# EAGLE design sensor_28mm (EAGLE 9.1.1)
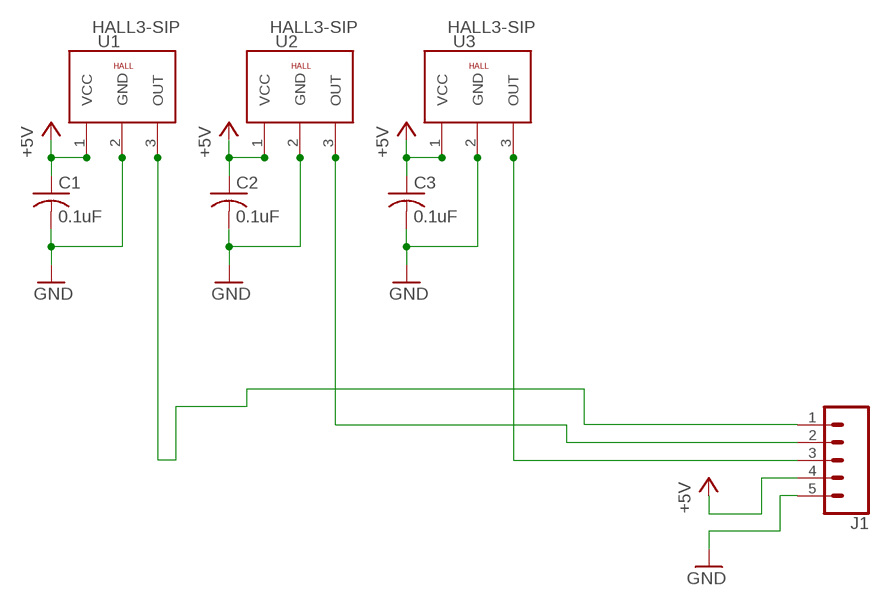
[diagram p0: schematic, sheet 1]

## Parts
C1  0.1uF  C-USC0603  [C0603]
C2  0.1uF  C-USC0603  [C0603]
C3  0.1uF  C-USC0603  [C0603]
J1  CONN_05PTH_LONGPADS  [1X05_LONGPADS]
U1  HALL3-SIP  [3PINS1,27]
U2  HALL3-SIP  [3PINS1,27]
U3  HALL3-SIP  [3PINS1,27]

## Nets
+5V: C1.1 C2.1 C3.1 J1.4 U1.1(VCC) U2.1(VCC) U3.1(VCC)
GND: C1.2 C2.2 C3.2 J1.5 U1.2(GND) U2.2(GND) U3.2(GND)
N$2: J1.1 U1.3(OUT)
N$4: J1.3 U3.3(OUT)
N$7: J1.2 U2.3(OUT)

## Library data of the parts
C1-C3 = sensor_28mm:C-US: CAPACITOR, American symbol
J1 = SparkFun-Connectors:CONN_05: Multi connection point. Often used as Generic Header-pin footprint for 0.1 inch spaced/style header connections On any of the 0.1 inch spaced packages, you can populate with these: Break Away Headers - Straight <https://www.sparkfun.com/products/116> (PRT-00116) Break Away Male Headers - Right Angle <https://www.sparkfun.com/products/553> (PRT-00553) Female Headers <https://www.sparkfun.com/products/115> (PRT-00115) Break Away Headers - Machine Pin <https://www.sparkfun.com/products/117> (PRT-00117) Break Away Female Headers - Swiss Machine Pin <https://www.sparkfun.com/products/743> (PRT-00743) For SCREWTERMINALS and SPRING TERMINALS visit here: Screw Terimnals on SparkFun.com <https://www.sparkfun.com/search/results?term=Screw+Terminals> (5mm/3.5mm/2.54mm spacing) This device is also useful as a general connection point to wire up your design to another part of your project. Our various solder wires solder well into these plated through hole pads. Hook-Up Wire - Assortment (Stranded, 22 AWG) <https://www.sparkfun.com/products/11375> (PRT-11375) Hook-Up Wire - Assortment (Solid Core, 22 AWG) <https://www.sparkfun.com/products/11367> (PRT-11367) View the entire wire category on our website here <https://www.sparkfun.com/categories/141> Special notes: Molex polarized connector foot print use with SKU : PRT-08231 with associated crimp pins and housings. 1MM SMD Version SKU: PRT-10208
U1-U3 = sensor_28mm:HALL

## Board
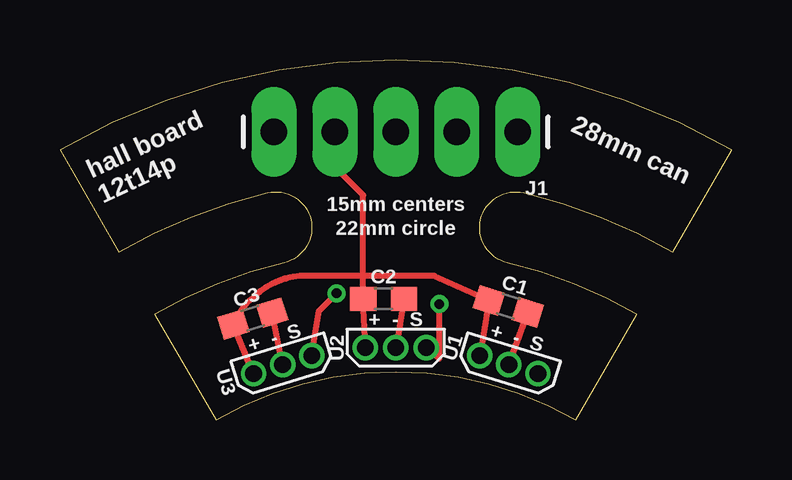
[diagram p1: board, top side]
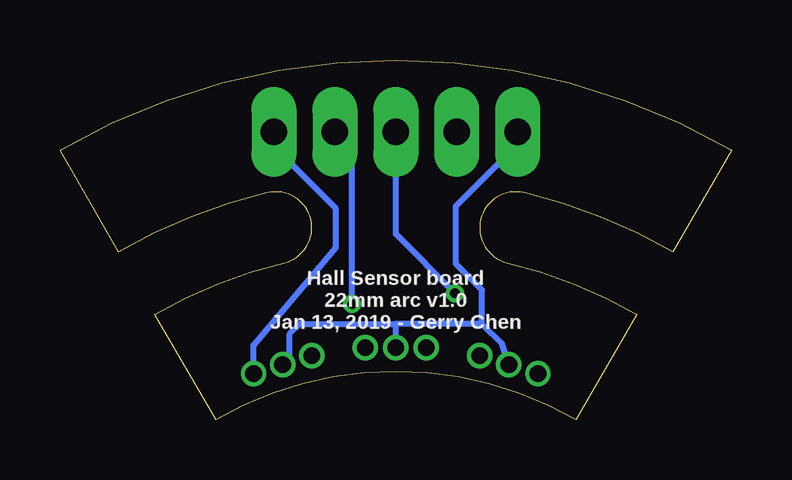
[diagram p2: board, bottom side, seen from below]

Size 28 x 15.01 mm. Coordinates in mm from the lower left corner, seen from the top.
Outline: 9.35,6.55 arc17 3.96,4.41 6.5,0 arc-60 21.5,0 24.04,4.41 arc17 18.65,6.55 arc-180 19.35,9.47 arc-17 25.54,7 28,11.26 arc60 0,11.26 2.46,7 arc-17 8.65,9.47 arc-180 9.35,6.55
Copper layers (1*16): Top 0.0356mm / dielectric 1.5011mm / Bottom 0.0356mm
Design rules "jlcpcb_tented": minimum track width 5mil, minimum drill 13mil, track to track 5mil, track to pad 5mil, pad to pad 5mil, via to via 5mil, smd to smd 5mil, copper to edge 15mil, drill to drill 6mil, minimum pad ring 7mil, minimum via ring 7mil, stop-mask expansion 2.5mil, vias tented up to drill 0.35mm, thermal gap 10mil

### Footprints (pad centres in the part's own frame; a part is rotated, then mirrored left to right if it is on the bottom)
C0603 = smd 1.1 x 1: 1 -0.85,0; 2 0.85,0
1X05_LONGPADS = drill 1.118 pad 1.88 long: 1 0,0; 2 2.54,0; 3 5.08,0; 4 7.62,0; 5 10.16,0
3PINS1,27 = drill 0.7 pad 1.016: 1 -1.27,0; 2 0,0; 3 1.27,0

### Placement (x,y rotation side)
C1  18.69,4.73 342.9 top
C2  13.49,5.05 0 top
C3  8.04,4.22 17.1 top
J1  19.08,12.01 180 top
U1  18.72,2.3 342.9 top
U2  14,3.01 0 top
U3  9.28,2.3 17.1 top

### Tracks (layer width: path | path; a pad name or v marks a point on that pad's centre or on a via)
+5V
  Top 0.254: U2.1 C2.1 12.64,5.01 12.64,6.01 | U3.1 C3.1 arc-60 10,6.01 13,6.01 | U1.1 C1.1 15.6,6.01 13,6.01 | 12.64,6.01 12.64,9.37 11.46,10.55 J1.4 | 13,6.01 12.64,6.01
GND
  Top 0.254: C2.2 U2.2 | U3.2 C3.2 | U1.2 C1.2
  Bottom 0.254: U2.2 14,4.01 | U3.2 9.58,3.19 10.4,4.01 | 10.4,4.01 14,4.01 | U1.2 18.42,2.59 18.42,3.59 18,4.01 14,4.01 | 10.4,4.01 10.4,5.41 11.5,6.51 11.5,8.91 9.7,10.71 9,11.41 9,11.93 J1.5
N$2
  Bottom 0.254: J1.1 19.08,11.39 16.5,8.81 16.5,7.18 19.93,3.11 U1.3
N$4  (via drill 0.4)
  Top 0.254: U3.3 10.79,4.54 v11.53,5.27
  Bottom 0.254: v11.53,5.27 14,7.74 J1.3
N$7  (via drill 0.4)
  Top 0.254: U2.3 15.82,2.56 v15.82,4.83
  Bottom 0.254: v15.82,4.83 15.82,11.61 J1.2

### Text on the board
tPlace: 28mm can | hall board / 12t14p | 15mm centers | 22mm circle
bPlace: Hall Sensor board / 22mm arc v1.0 / Jan 13, 2019 - Gerry Chen